# Altium schematic sheet CAN.SchDoc
size A4
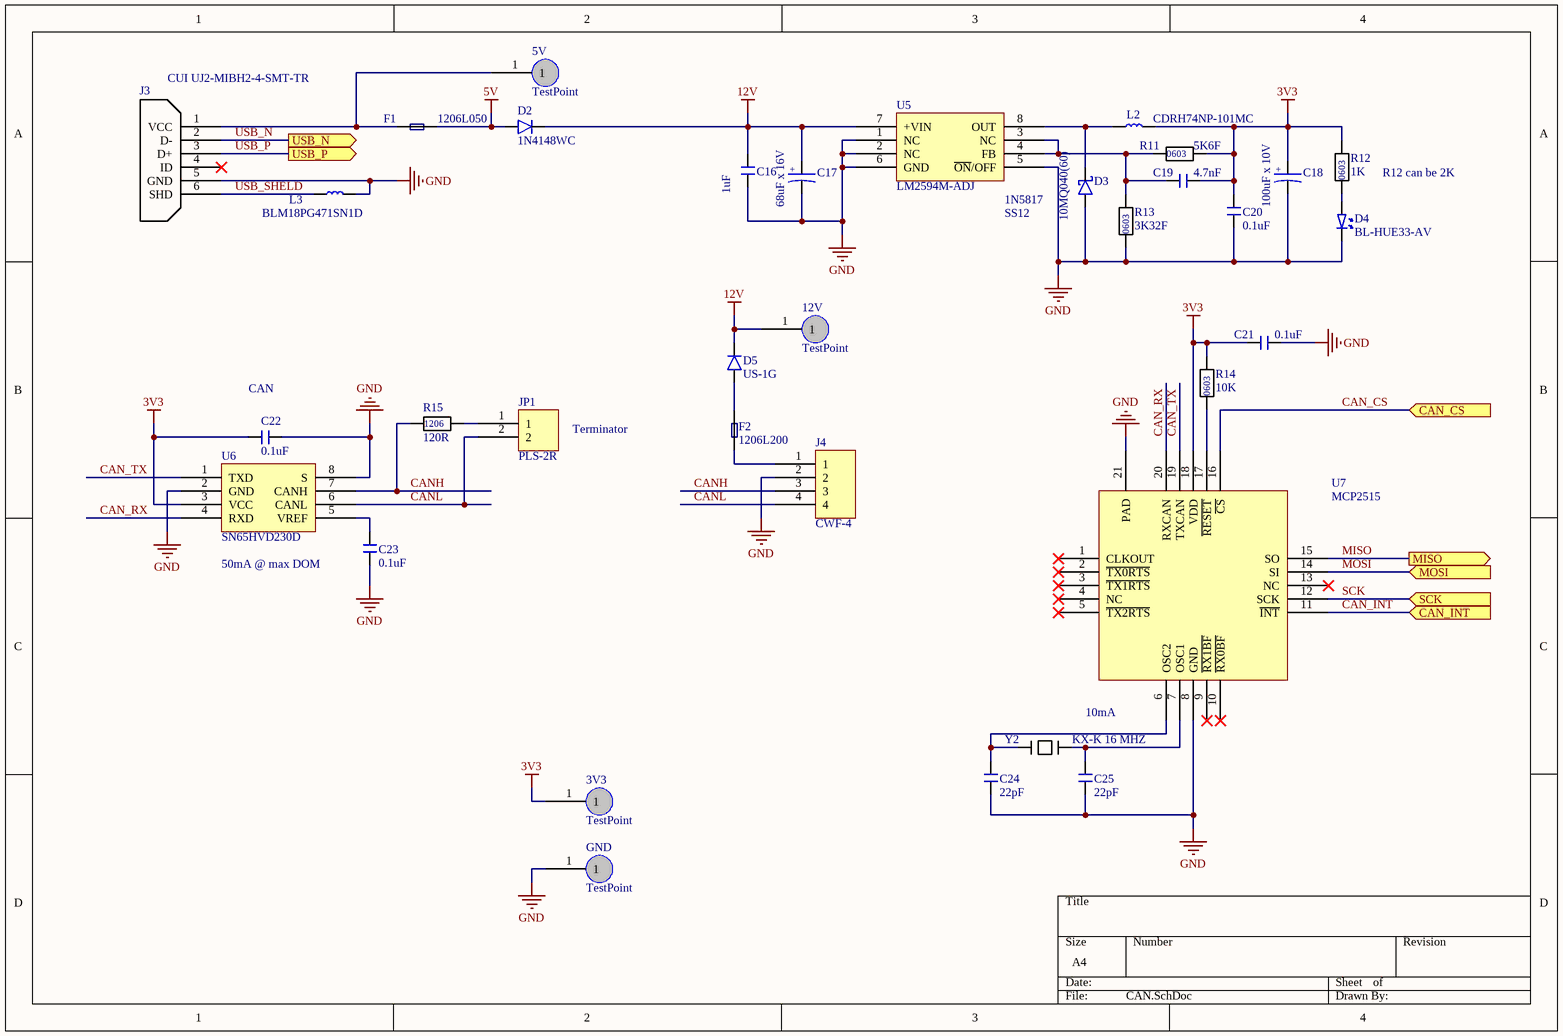
[diagram p0: CAN.SchDoc]

## Parts
3V3  TestPoint  [TestPoint]
5V  TestPoint  [TestPoint]
12V  TestPoint  [TestPoint]
C16  1uF  [CHIP_C_0805]
C17  68uF x 16V  [TANTAL - C]
C18  100uF x 10V  [Tantal - B]
C19  4.7nF  [CHIP_C_0603]
C20  0.1uF  [CHIP_C_0603]
C21  0.1uF  [CHIP_C_0603]
C22  0.1uF  [CHIP_C_0603]
C23  0.1uF  [CHIP_C_0603]
C24  22pF  [CHIP_C_0603]
C25  22pF  [CHIP_C_0603]
D2  1N4148WC  [SOD323]
D3  10MQ040(60)  [DO214-AC]
D4  BL-HUE33-AV  [CHIP_D_0603]
D5  US-1G  [DO214-AC]
F1  1206L050  [1206Lxxx]
F2  1206L200  [1206Lxxx]
GND  TestPoint  [TestPoint]
J3  CUI UJ2-MIBH2-4-SMT-TR  [MicroUSB-mc-258]
J4  CWF-4  [CWF-4R]
JP1  PLS-2R  [PLS-2R]
L2  CDRH74NP-101MC  [CDRH74]
L3  BLM18PG471SN1D  [CHIP_R_0603]
R11  5K6F  [CHIP_R_0603]
R12  1K  [CHIP_R_0603]
R13  3K32F  [CHIP_R_0603]
R14  10K  [CHIP_R_0603]
R15  120R  [CHIP_R_1206]
U5  LM2594M-ADJ  [SOIC8]
U6  SN65HVD230D  [SOIC8]
U7  MCP2515  [QFN20]
Y2  KX-K 16 MHZ  [CHIP_CRYSTAL_5032]

## Ports
CAN_CS (in), CAN_INT (in), MISO (out), MOSI (in), SCK (in), USB_N (out), USB_P (out)

## Nets
3V3: 3V3.1 C18.1 C19.1 C20.2 C21.2 C22.2 L2.2 R11.2 R12.2 R14.2 U6.3(VCC) U7.18(VDD)
5V: D2.2 F1.2
12V: 12V.1 C16.2 C17.1 D2.1 D5.2 U5.7(+VIN)
GND: C16.1 C17.2 C18.2 C20.1 C21.1 C22.1 C23.1 C24.1 C25.1 D3.1 D4.2(C) GND.1 J3.5(GND) J4.2 L3.2 R13.1 U5.1(NC) U5.2(NC) U5.5(~{ON}/OFF) U5.6(GND) U6.2(GND) U6.8(S) U7.8(GND) U7.21(PAD)
CAN_CS: U7.16(~{CS}) ; port CAN_CS
CAN_INT: U7.11(~{INT}) ; port CAN_INT
CAN_RX: U6.4(RXD) U7.20(RXCAN)
CAN_TX: U6.1(TXD) U7.19(TXCAN)
CANH: J4.3 R15.1 U6.7(CANH)
CANL: J4.4 JP1.2 U6.6(CANL)
MISO: U7.15(SO) ; port MISO
MOSI: U7.14(SI) ; port MOSI
SCK: U7.12(SCK) ; port SCK
USB_N: J3.2(D-) ; port USB_N
USB_P: J3.3(D+) ; port USB_P
USB_SHELD: J3.6(SHD) L3.1
Net5V_1: 5V.1 F1.1 J3.1(VCC)
NetC19_2: C19.2 R11.1 R13.2 U5.3(NC) U5.4(FB)
NetC23_2: C23.2 U6.5(VREF)
NetC24_2: C24.2 U7.6(OSC2) Y2.1
NetC25_2: C25.2 U7.7(OSC1) Y2.2
NetD3_2: D3.2 L2.1 U5.8(OUT)
NetD4_1: D4.1(A) R12.1
NetD5_1: D5.1 F2.2
NetF2_1: F2.1 J4.1
NetJP1_1: JP1.1 R15.2
NetR14_1: R14.1 U7.17(~{RESET})

Not connected (* = marked no-connect by the designer): J3 4(ID)*; U7 1(CLKOUT)* 2(~{TX0RTS})* 3(~{TX1RTS})* 4(NC)* 5(~{TX2RTS})* 9(~{RX1BF})* 10(~{RX0BF})* 13(NC)*

## Notes on the sheet
- R12 can be 2K
- 1N5817
- SS12
- (near C22) CAN
- Terminator
- 50mA @ max DOM
- 10mA
- (in symbol RES_0603) 0603
- (in symbol RES_1206) 1206
- (in symbol Tantal) +

## Library data of the parts
C16 C19-C25 = CHIP_C
C17 C18 = Tantal
D3 = 10MQ040: Rectifier diode
D4 = KP-3216: LED
F1 = miniSMDC014F-2: Fuse
F2 = miniSMDC014F-2
J3 = USB_micro: Micro USB connector
JP1 = PLS-2
L2 = CDRH74: Ferrite drum core construction
L3 = BLM
R11-R14 = RES_0603
R15 = RES_1206
U5 = LM2594
U6 = TJA1050
U7 = MCP2515_QFN
Y2 = Quartz